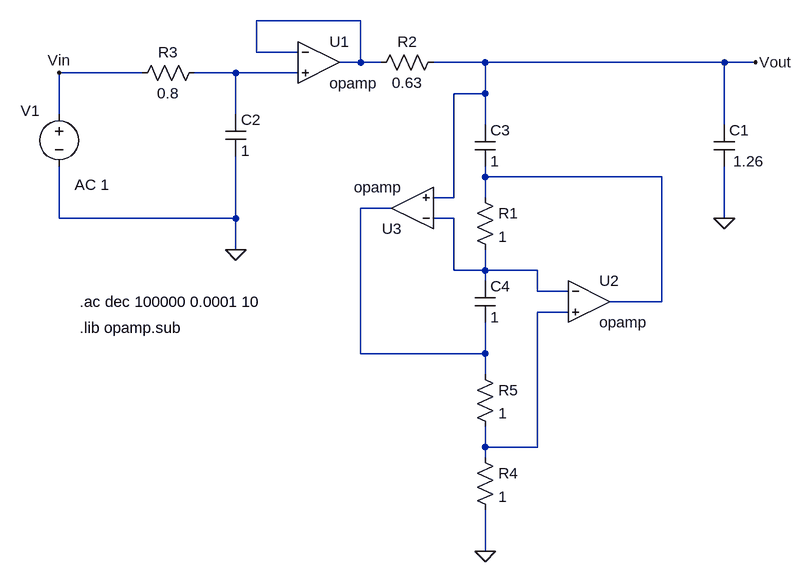
[diagram p0: schematic FDNR(inductor-serie).asc]
FDNR(inductor-serie).asc, the LTspice schematic file:
Version 4
SHEET 1 932 964
WIRE 160 128 0 128
WIRE 0 176 0 128
WIRE 64 176 0 176
WIRE 160 192 160 128
WIRE 160 192 128 192
WIRE 192 192 160 192
WIRE 352 192 272 192
WIRE 720 192 352 192
WIRE 768 192 720 192
WIRE -176 208 -304 208
WIRE -32 208 -96 208
WIRE 64 208 -32 208
WIRE 352 240 352 192
WIRE 352 240 304 240
WIRE -304 272 -304 208
WIRE -32 272 -32 208
WIRE 352 288 352 240
WIRE 720 288 720 192
WIRE 352 368 352 352
WIRE 624 368 352 368
WIRE 304 400 304 240
WIRE 304 400 272 400
WIRE 352 400 352 368
WIRE 208 416 160 416
WIRE -304 432 -304 352
WIRE -32 432 -32 336
WIRE -32 432 -304 432
WIRE 304 432 272 432
WIRE 720 432 720 352
WIRE -32 480 -32 432
WIRE 304 512 304 432
WIRE 352 512 352 480
WIRE 352 512 304 512
WIRE 432 512 352 512
WIRE 352 528 352 512
WIRE 432 544 432 512
WIRE 480 544 432 544
WIRE 624 560 624 368
WIRE 624 560 544 560
WIRE 480 576 432 576
WIRE 160 640 160 416
WIRE 352 640 352 592
WIRE 352 640 160 640
WIRE 352 672 352 640
WIRE 352 784 352 752
WIRE 432 784 432 576
WIRE 432 784 352 784
WIRE 352 800 352 784
WIRE 352 944 352 880
FLAG -304 208 Vin
FLAG 768 192 Vout
FLAG -32 480 0
FLAG 720 432 0
FLAG 352 944 0
SYMBOL voltage -304 256 R0
WINDOW 123 24 124 Left 2
WINDOW 39 0 0 Left 0
WINDOW 0 -59 10 Left 2
SYMATTR Value2 AC 1
SYMATTR InstName V1
SYMATTR Value ""
SYMBOL OpAmps\\opamp 96 128 R0
SYMATTR InstName U1
SYMBOL res -80 192 R90
WINDOW 0 0 56 VBottom 2
WINDOW 3 32 56 VTop 2
SYMATTR InstName R3
SYMATTR Value 0.8
SYMBOL cap -48 272 R0
SYMATTR InstName C2
SYMATTR Value 1
SYMBOL res 288 176 R90
WINDOW 0 0 56 VBottom 2
WINDOW 3 32 56 VTop 2
SYMATTR InstName R2
SYMATTR Value 0.63
SYMBOL cap 704 288 R0
WINDOW 3 30 56 Left 2
SYMATTR Value 1.26
SYMATTR InstName C1
SYMBOL cap 336 288 R0
SYMATTR InstName C3
SYMATTR Value 1
SYMBOL res 336 384 R0
SYMATTR InstName R1
SYMATTR Value 1
SYMBOL res 336 656 R0
SYMATTR InstName R5
SYMATTR Value 1
SYMBOL OpAmps\\opamp 512 496 R0
SYMATTR InstName U2
SYMBOL OpAmps\\opamp 240 480 R180
SYMATTR InstName U3
SYMBOL cap 336 528 R0
SYMATTR InstName C4
SYMATTR Value 1
SYMBOL res 336 784 R0
SYMATTR InstName R4
SYMATTR Value 1
TEXT -272 600 Left 2 !.lib opamp.sub
TEXT -272 560 Left 2 !.ac dec 100000 0.0001 10

The netlist it stands for:
* FDNR(inductor-serie).asc
V1 Vin 0 AC 1
XU1 N001 N002 N001 opamp Aol=100K GBW=10Meg  ; pins invin noninvin out
R3 N002 Vin 0.8
C2 N002 0 1
R2 Vout N001 0.63
C1 Vout 0 1.26
C3 Vout N003 1
R1 N003 N005 1
R5 N004 N006 1
XU2 N005 N006 N003 opamp Aol=100K GBW=10Meg  ; pins invin noninvin out
XU3 N005 Vout N004 opamp Aol=100K GBW=10Meg  ; pins invin noninvin out
C4 N005 N004 1
R4 N006 0 1
.lib opamp.sub
.ac dec 100000 0.0001 10
.backanno
.end